# Altium schematic sheet Axis Channel.SchDoc
size A
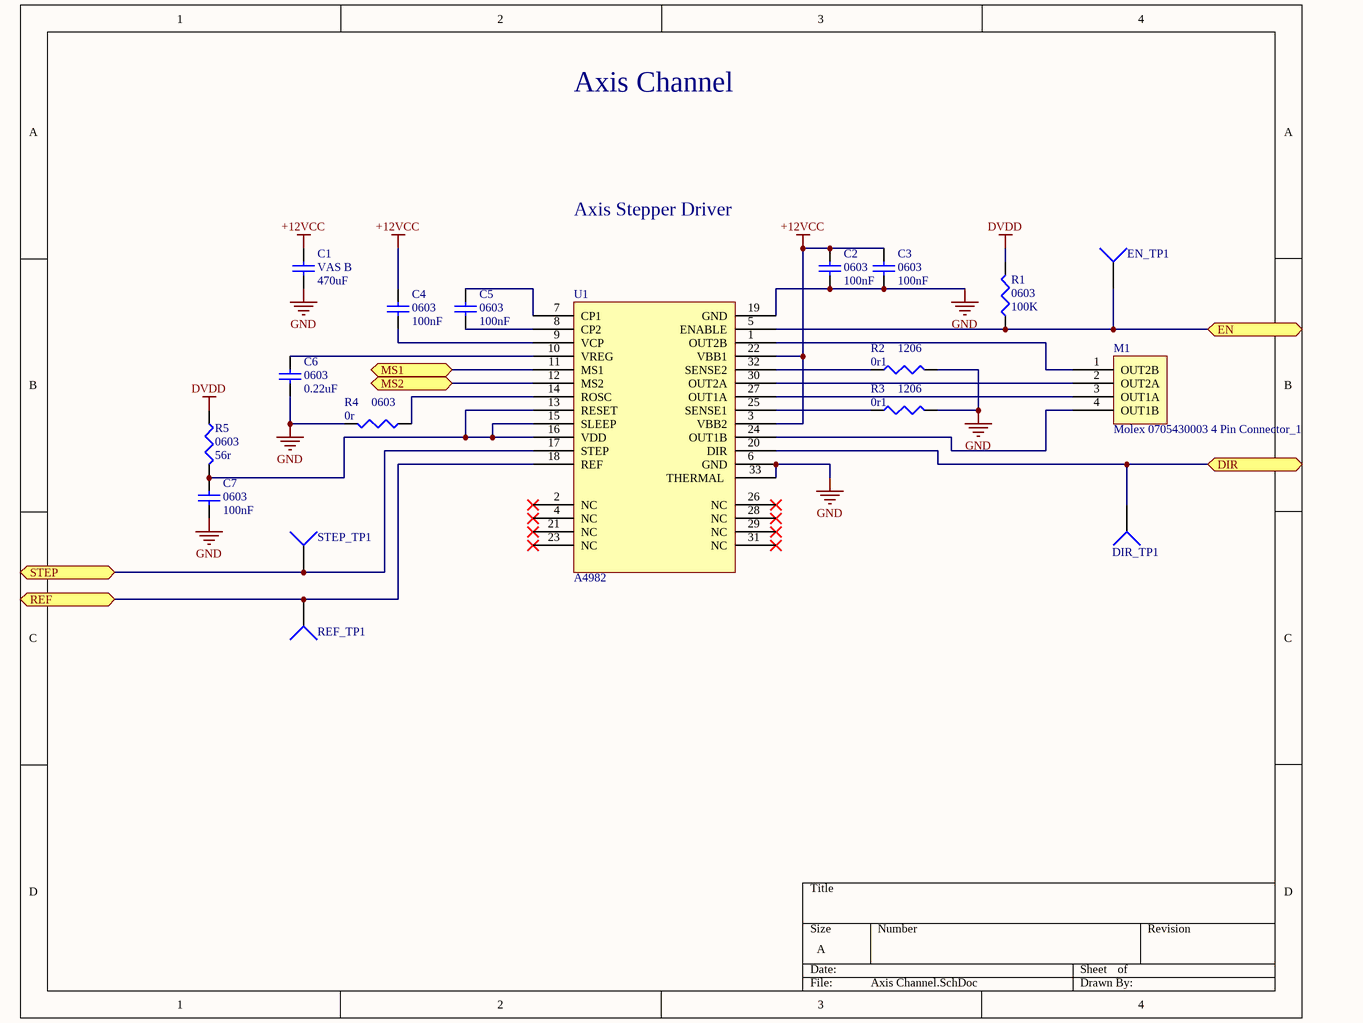
[diagram p0: Axis Channel.SchDoc]

## Parts
C1  VAS B  value 470uF  [Panasonic VS B]
C2  0603  value 100nF  [1608[0603]]
C3  0603  value 100nF  [1608[0603]]
C4  0603  value 100nF  [1608[0603]]
C5  0603  value 100nF  [1608[0603]]
C6  0603  value 0.22uF  [1608[0603]]
C7  0603  value 100nF  [1608[0603]]
DIR_TP1  TP4  [PIN1]  (value not drawn)
EN_TP1  TP4  [PIN1]  (value not drawn)
M1  Molex 0705430003 4 Pin Connector_1  [Molex 0705430003]
R1  0603  value 100K  [J1-0603]
R2  1206  value 0r1  [1206 SMD Resistor]
R3  1206  value 0r1  [1206 SMD Resistor]
R4  0603  value 0r  [J1-0603]
R5  0603  value 56r  [J1-0603]
REF_TP1  TP4  [PIN1]  (value not drawn)
STEP_TP1  TP4  [PIN1]  (value not drawn)
U1  A4982  [QFN50P508X508X100_HS-33N]

## Ports
DIR, EN, MS1, MS2, REF, STEP

## Nets
+12VCC: C1.2 C2.2 C3.2 C4.2 U1.3(VBB2) U1.22(VBB1)
DVDD: R1.2 R5.1
GND: C1.1 C2.1 C3.1 C6.1 C7.1 R2.2 R3.2 R4.2 U1.6(GND) U1.19(GND) U1.33(THERMAL)
DIR: DIR_TP1.1 U1.20(DIR) ; port DIR
EN: EN_TP1.1 R1.1 U1.5(ENABLE) ; port EN
MS1: U1.11(MS1) ; port MS1
MS2: U1.12(MS2) ; port MS2
REF: REF_TP1.1 U1.18(REF) ; port REF
STEP: STEP_TP1.1 U1.17(STEP) ; port STEP
NetC4_1: C4.1 U1.9(VCP)
NetC5_1: C5.1 U1.8(CP2)
NetC5_2: C5.2 U1.7(CP1)
NetC6_2: C6.2 U1.10(VREG)
NetC7_2: C7.2 R5.2 U1.13(RESET) U1.15(SLEEP) U1.16(VDD)
NetM1_1: M1.1(OUT2B) U1.1(OUT2B)
NetM1_2: M1.2(OUT2A) U1.30(OUT2A)
NetM1_3: M1.3(OUT1A) U1.27(OUT1A)
NetM1_4: M1.4(OUT1B) U1.24(OUT1B)
NetR2_1: R2.1 U1.32(SENSE2)
NetR3_1: R3.1 U1.25(SENSE1)
NetR4_1: R4.1 U1.14(ROSC)

Not connected (* = marked no-connect by the designer): U1 2(NC)* 4(NC)* 21(NC)* 23(NC)* 26(NC)* 28(NC)* 29(NC)* 31(NC)*

## Notes on the sheet
- Axis Channel
- Axis Stepper Driver

## Library data of the parts
C1-C7 = Cap Semi: Capacitor (Semiconductor SIM Model); Published: 8-Jun-2000; LatestRevisionDate: 29-May-2009; LatestRevisionNote: IPC-7351 Footprint Added.; PackageReference: C1206; Publisher: Altium Limited; PackageDescription: Chip Capacitor
DIR_TP1 EN_TP1 REF_TP1 STEP_TP1 = Socket: LatestRevisionDate: 17-Jul-2002; LatestRevisionNote: Re-released for DXP Platform.; Publisher: Altium Limited
R1-R5 = Res3: Resistor; Published: 8-Jun-2000; LatestRevisionDate: 29-May-2009; LatestRevisionNote: IPC-7351 Footprint Added.; PackageReference: J1-0603; Publisher: Altium Limited; PackageDescription: Chip Resistor
U1 = A4982: Alllegor A4982 Stepper Driver